# Altium schematic sheet 电源小板.SchDoc
size A4
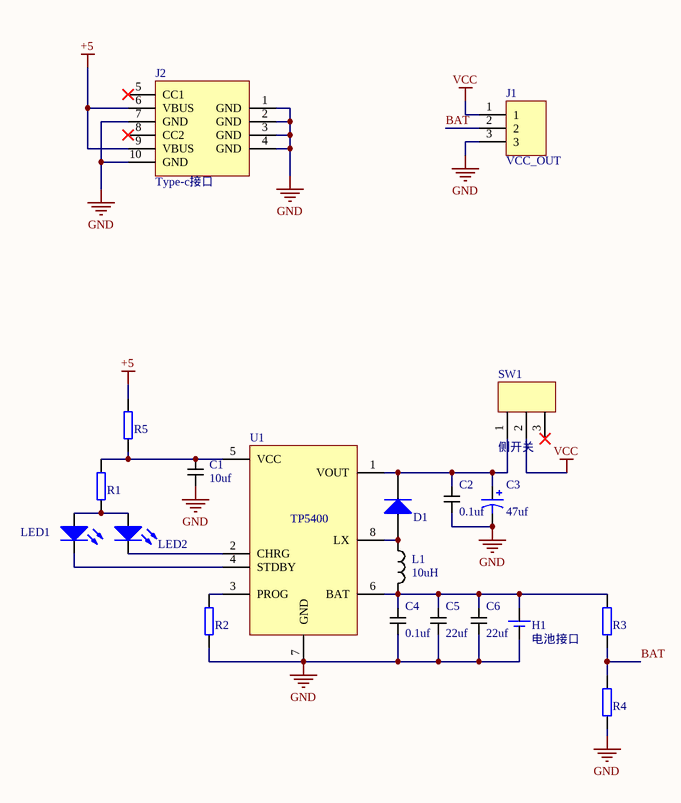
[diagram p0: 电源小板.SchDoc]

## Parts
C1  10uf  [0603-CAP]
C2  0.1uf  [0603-CAP]
C3  47uf  [电解电容]
C4  0.1uf  [0603-CAP]
C5  22uf  [0603-CAP]
C6  22uf  [0603-CAP]
D1  二极管  [DO-214AC]  (value not drawn)
H1  电池接口  [PH2.0]
J1  VCC_OUT  [ZH1.5]
J2  Type-c接口  [type-c]
L1  10uH  [功率电感]
LED1  发光二极管  [0603-LED]  (value not drawn)
LED2  发光二极管  [0603-LED]  (value not drawn)
R1  电阻  [0603-RES]  (value not drawn)
R2  电阻  [0603-RES]  (value not drawn)
R3  电阻  [0603-RES]  (value not drawn)
R4  电阻  [0603-RES]  (value not drawn)
R5  电阻  [0603-RES]  (value not drawn)
SW1  侧开关  [开关]
U1  TP5400  [TP5400]

## Nets
+5: J2.6(VBUS) J2.9(VBUS) R5.1
GND: C1.2 C2.2 C3.2 C4.2 C5.2 C6.2 H1.2(负极) J1.3 J2.1(GND) J2.2(GND) J2.3(GND) J2.4(GND) J2.7(GND) J2.10(GND) R2.2 R4.2 U1.7(GND)
VCC: J1.1 SW1.2
BAT: J1.2 R3.2 R4.1
NetC1_1: C1.1 R1.1 R5.2 U1.5(VCC)
NetC2_1: C2.1 C3.1 D1.2(K) SW1.1 U1.1(VOUT)
NetC4_1: C4.1 C5.1 C6.1 H1.1(正极) L1.2 R3.1 U1.6(BAT)
NetD1_1: D1.1(A) L1.1 U1.8(LX)
NetLED1_1: LED1.1 LED2.1 R1.2
NetLED1_2: LED1.2 U1.4(STDBY)
NetLED2_2: LED2.2 U1.2(CHRG)
NetR2_1: R2.1 U1.3(PROG)

Not connected (* = marked no-connect by the designer): J2 5(CC1)* 8(CC2)*; SW1 3*

## Library data of the parts
C1 C2 C4-C6 = 电容: 无极性贴片电容
C3 = 极性电容: 极性直插电容; name: Cap Pol
D1 = 二极管: 通用二极管
H1 = 电池接口: 接电池用的
J2 = Type-c接口: 接口
L1 = 电感: 普通电感; Code_IEC: 1005; Published: 8-Jun-2000; LatestRevisionDate: 29-May-2009; LatestRevisionNote: IPC-7351 Footprint Added.; PackageReference: 0402-A; Publisher: Altium Limited; PackageDescription: Chip Inductor; Code_JEITA: 0402
U1 = TP5400: 电源管理芯片